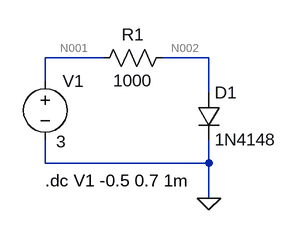
[diagram p0: schematic diode2.asc]
diode2.asc, the LTspice schematic file:
Version 4.1
SHEET 1 880 680
WIRE 144 -16 64 -16
WIRE 288 -16 224 -16
WIRE 64 16 64 -16
WIRE 288 32 288 -16
WIRE 64 128 64 96
WIRE 288 128 288 96
WIRE 288 128 64 128
WIRE 288 176 288 128
FLAG 288 176 0
SYMBOL diode 272 32 R0
SYMATTR InstName D1
SYMATTR Value 1N4148
SYMBOL voltage 64 0 R0
WINDOW 123 15 127 Left 2
WINDOW 39 24 124 Left 2
WINDOW 3 15 99 Left 2
SYMATTR Value 3
SYMATTR InstName V1
SYMBOL res 240 -32 R90
WINDOW 0 0 56 VBottom 2
WINDOW 3 32 56 VTop 2
SYMATTR InstName R1
SYMATTR Value 1000
TEXT 64 152 Left 2 !.dc V1 -0.5 0.7 1m

The netlist it stands for:
* diode2.asc
D1 N002 0 1N4148
V1 N001 0 3
R1 N002 N001 1000
.model D D
.lib standard.dio
.dc V1 -0.5 0.7 1m
.backanno
.end

* Results of the author's LTspice run, read from the files saved beside the schematic
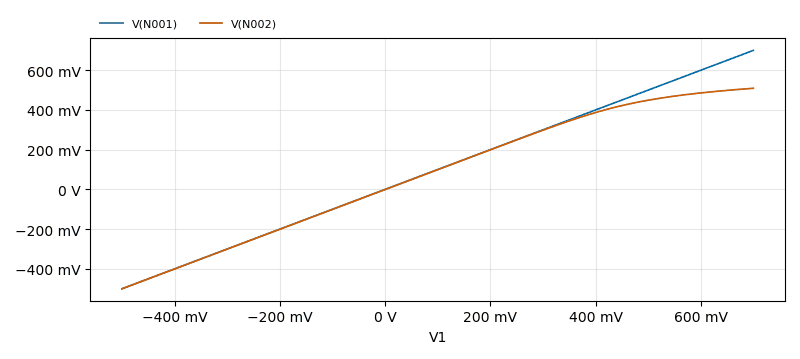
[diagram p1: DC transfer characteristic of diode2.asc, plotted from the saved traces]
* DC transfer characteristic, 1 run:
*   V(N001): -500 mV at V1=-500 mV, 700 mV at V1=700 mV, min -500 mV, max 700 mV
*   V(N002): -500 mV at V1=-500 mV, 509.2 mV at V1=700 mV, min -500 mV, max 509.2 mV